# Altium project DE-140824.PrjPcb
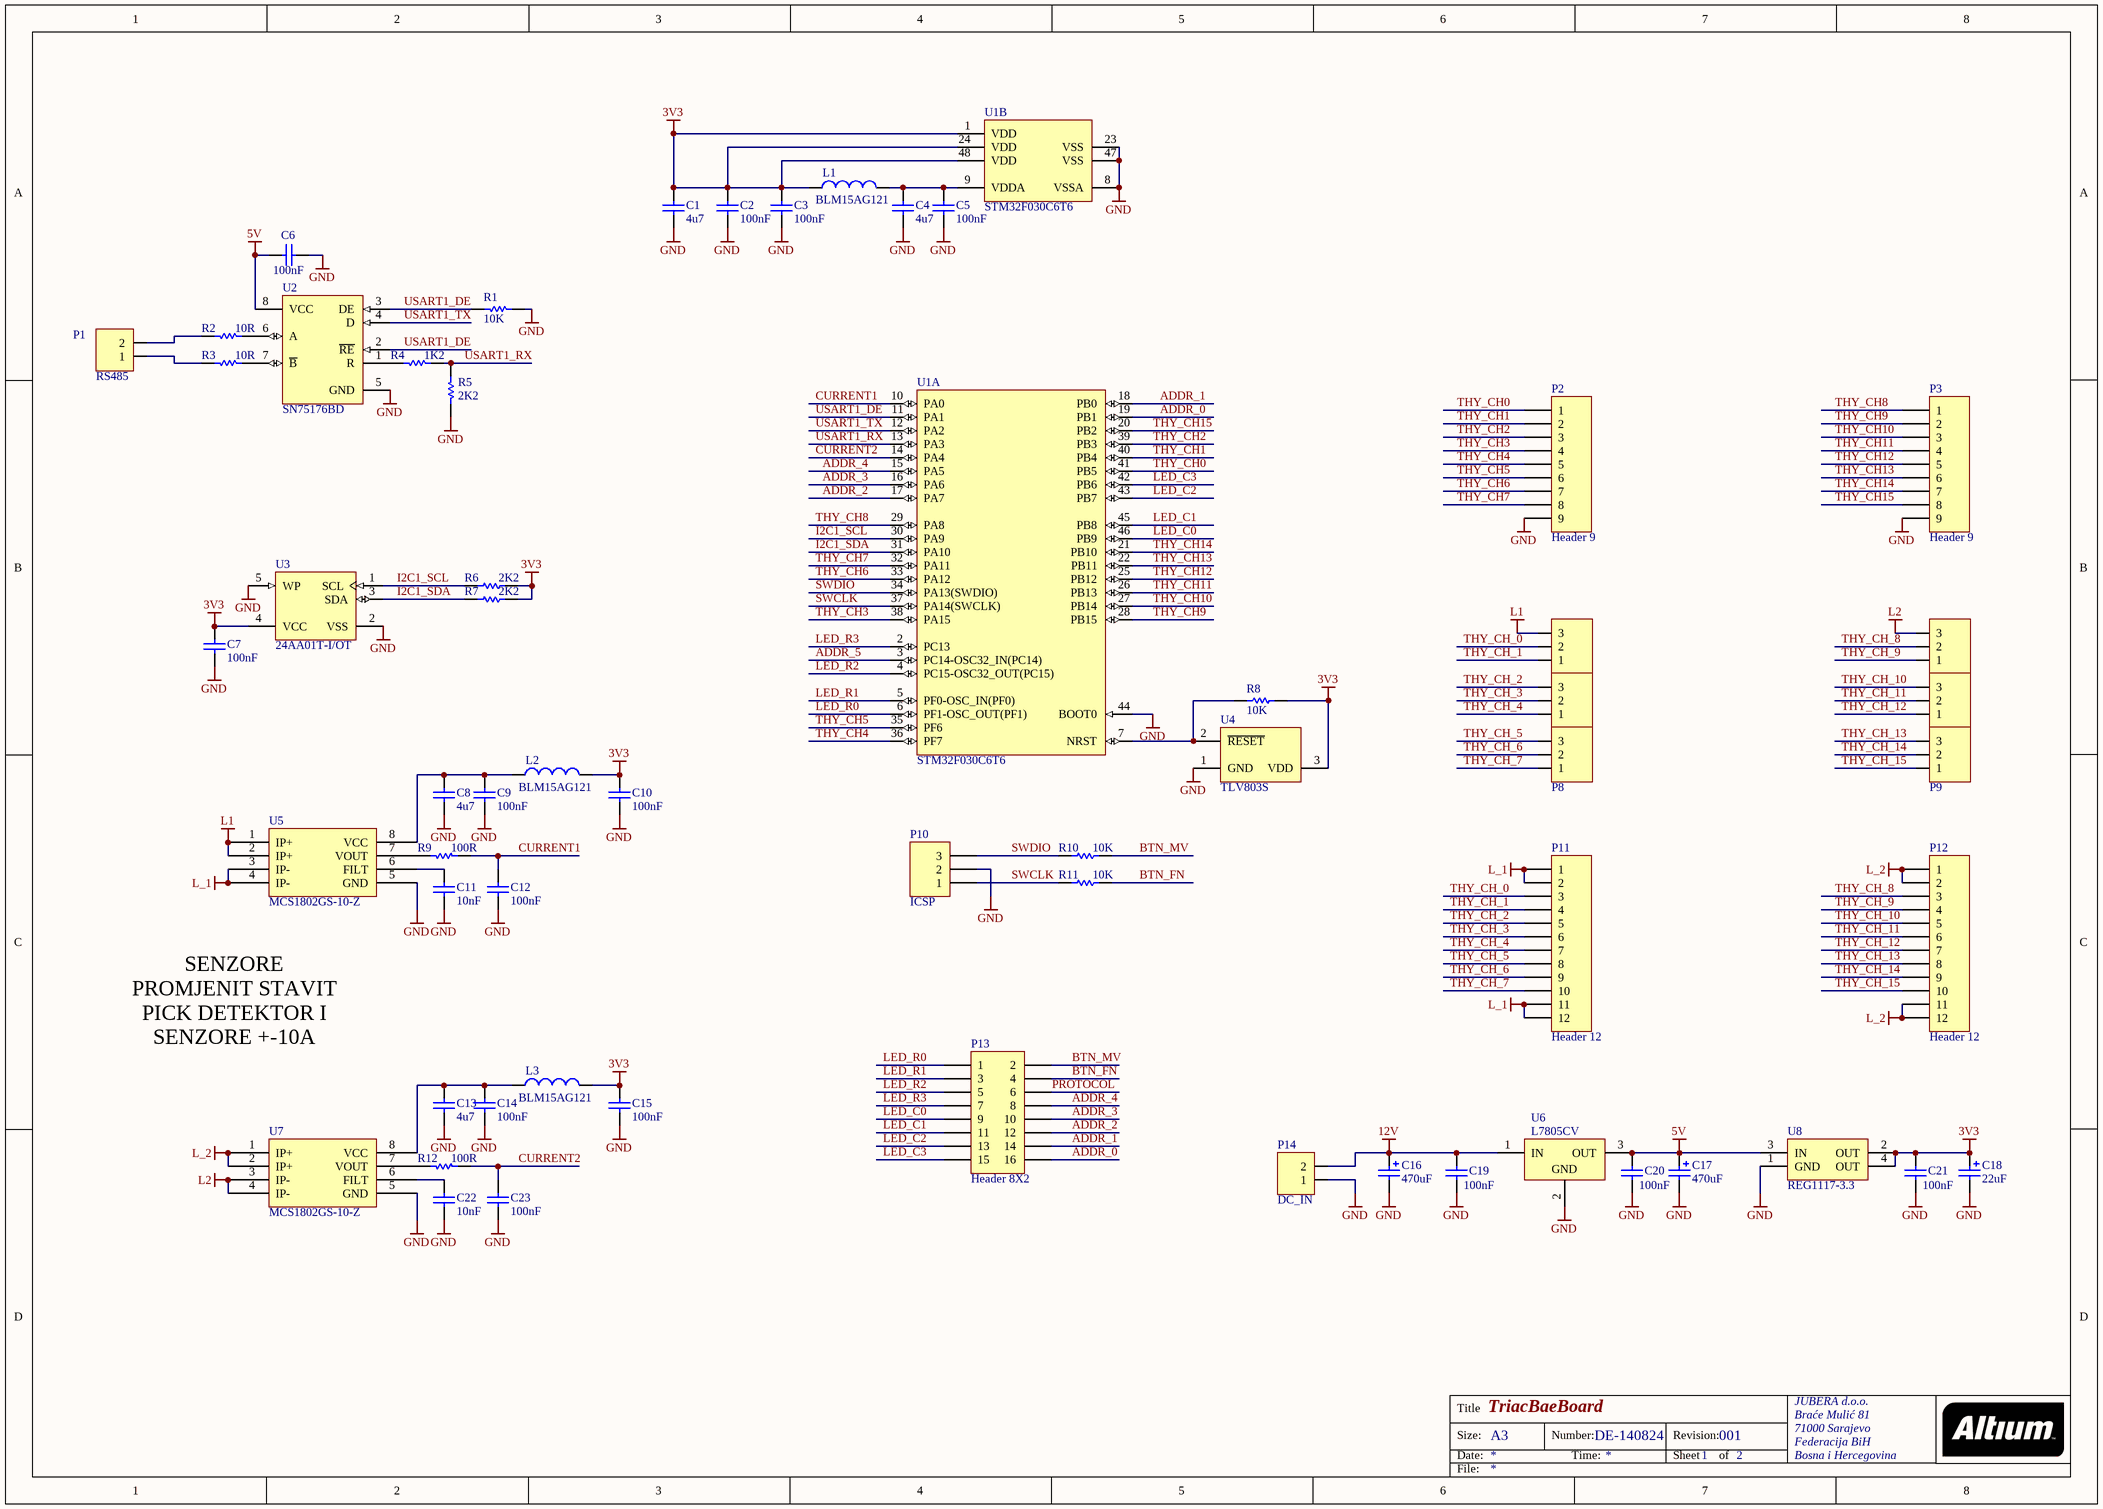
[diagram p0: DE-140824.SchDoc]
2 sheets, 202 parts. Net scope: global (net labels, ports and power ports of the same name join across sheets).
Board files: DE-140824.PcbDoc, DE-140824_1.PcbDoc
Sheets:
  DE-140824.SchDoc
  DE-140824_01.SchDoc

## Sheet DE-140824.SchDoc: TriacBaeBoard
size A3; Author: eldar6776@hotmail.com; DrawnBy: Eldar Dedic; Organization: JUBERA d.o.o.; Address1: Braće Mulić 81; Address2: 71000 Sarajevo; Address3: Federacija BiH; Address4: Bosna i Hercegovina; DocumentNumber: DE-140824; Revision: 001; SheetNumber: 1; SheetTotal: 2

### Parts
C1  value 4u7  [0805]  (hidden comment: C0805)
C2  value 100nF  [0603]  (hidden comment: C0603)
C3  value 100nF  [0603]  (hidden comment: C0603)
C4  value 4u7  [0805]  (hidden comment: C0805)
C5  value 100nF  [0603]  (hidden comment: C0603)
C6  100nF  [0603]
C7  value 100nF  [0603]  (hidden comment: C0603)
C8  value 4u7  [0805]  (hidden comment: C0805)
C9  value 100nF  [0603]  (hidden comment: C0603)
C10  value 100nF  [0603]  (hidden comment: C0603)
C11  value 10nF  [0603]  (hidden comment: C0603)
C12  value 100nF  [0603]  (hidden comment: C0603)
C13  value 4u7  [0805]  (hidden comment: C0805)
C14  value 100nF  [0603]  (hidden comment: C0603)
C15  value 100nF  [0603]  (hidden comment: C0603)
C16  470uF  [CAPPR5-10X12.5]
C17  470uF  [CAPPR5-10X12.5]
C18  22uF  [CAPPR2-5X11]
C19  100nF  [0603]
C20  100nF  [0603]
C21  100nF  [0603]
C22  value 10nF  [0603]  (hidden comment: C0603)
C23  value 100nF  [0603]  (hidden comment: C0603)
L1  BLM15AG121  [0402-A]
L2  BLM15AG121  [0402-A]
L3  BLM15AG121  [0402-A]
P1  RS485  [TERMINAL BLOK 2]
P2  Header 9  [HDR1X9]
P3  Header 9  [HDR1X9]
P4  (no value)  [TERMINAL BLOK 3]
P5  (no value)  [TERMINAL BLOK 3]
P6  (no value)  [TERMINAL BLOK 3]
P7  (no value)  [TERMINAL BLOK 3]
P8  (no value)  [TERMINAL BLOK 3]
P9  (no value)  [TERMINAL BLOK 3]
P10  ICSP  [HDR1X3]
P11  Header 12  [HDR1X12]
P12  Header 12  [HDR1X12]
P13  Header 8X2  [HDR2X8]
P14  DC_IN  [TERMINAL BLOK 2]
R1  10K  [ERA-0603]
R2  10R  [ERA-0603]
R3  10R  [ERA-0603]
R4  1K2  [ERA-0603]
R5  2K2  [ERA-0603]
R6  2K2  [ERA-0603]
R7  2K2  [ERA-0603]
R8  10K  [ERA-0603]
R9  100R  [ERA-0603]
R10  10K  [ERA-0603]
R11  10K  [ERA-0603]
R12  100R  [ERA-0603]
U1  STM32F030C6T6  [STM-LQFP48_N]  (parts A,B of 2)
U2  SN75176BD  [D008_N]
U3  24AA01T-I/OT  [SOT-23-OT5_N]
U4  TLV803S  [DBZ3_N]
U5  MCS1802GS-10-Z  [SOIC-SN8_N]
U6  L7805CV  [TO220]
U7  MCS1802GS-10-Z  [SOIC-SN8_N]
U8  REG1117-3.3  [ZZ311]

### Nets
3V3: C1.2 C2.2 C3.2 C7.2 C10.2 C15.2 C18.1 C21.2 L1.1 L2.2 L3.2 R6.2 R7.2 R8.2 U1.1(VDD) U1.24(VDD) U1.48(VDD) U3.4(VCC) U4.3(VDD) U8.2(OUT) U8.4(OUT)
5V: C6.1 C17.1 C20.2 U2.8(VCC) U6.3(OUT) U8.3(IN)
12V: C16.1 C19.2 P14.2 U6.1(IN)
GND: C1.1 C2.1 C3.1 C4.1 C5.1 C6.2 C7.1 C8.1 C9.1 C10.1 C11.1 C12.1 C13.1 C14.1 C15.1 C16.2 C17.2 C18.2 C19.1 C20.1 C21.1 C22.1 C23.1 P2.9 P3.9 P10.2 P14.1 R1.1 R5.2 U1.8(VSSA) U1.23(VSS) U1.44(BOOT0) U1.47(VSS) U2.5(GND) U3.2(VSS) U3.5(WP) U4.1(GND) U5.5(GND) U6.2(GND) U7.5(GND) U8.1(GND)
L1: P4.3 U5.1(IP+) U5.2(IP+)
L2: P5.3 U7.3(IP-) U7.4(IP-)
L_1: P11.1 P11.2 P11.11 P11.12 U5.3(IP-) U5.4(IP-)
L_2: P12.1 P12.2 P12.11 P12.12 U7.1(IP+) U7.2(IP+)
ADDR_0: P13.16 U1.19(PB1)
ADDR_1: P13.14 U1.18(PB0)
ADDR_2: P13.12 U1.17(PA7)
ADDR_3: P13.10 U1.16(PA6)
ADDR_4: P13.8 U1.15(PA5)
ADDR_5: U1.3(PC14-OSC32_IN(PC14))
BTN_FN: P13.4 R11.2
BTN_MV: P13.2 R10.2
CURRENT1: C12.2 R9.1 U1.10(PA0)
CURRENT2: C23.2 R12.1 U1.14(PA4)
I2C1_SCL: R6.1 U1.30(PA9) U3.1(SCL)
I2C1_SDA: R7.1 U1.31(PA10) U3.3(SDA)
LED_C0: P13.9 U1.46(PB9)
LED_C1: P13.11 U1.45(PB8)
LED_C2: P13.13 U1.43(PB7)
LED_C3: P13.15 U1.42(PB6)
LED_R0: P13.1 U1.6(PF1-OSC_OUT(PF1))
LED_R1: P13.3 U1.5(PF0-OSC_IN(PF0))
LED_R2: P13.5 U1.4(PC15-OSC32_OUT(PC15))
LED_R3: P13.7 U1.2(PC13)
PROTOCOL: P13.6
SWCLK: P10.1 R11.1 U1.37(PA14(SWCLK))
SWDIO: P10.3 R10.1 U1.34(PA13(SWDIO))
THY_CH0: P2.1 U1.41(PB5)
THY_CH1: P2.2 U1.40(PB4)
THY_CH2: P2.3 U1.39(PB3)
THY_CH3: P2.4 U1.38(PA15)
THY_CH4: P2.5 U1.36(PF7)
THY_CH5: P2.6 U1.35(PF6)
THY_CH6: P2.7 U1.33(PA12)
THY_CH7: P2.8 U1.32(PA11)
THY_CH8: P3.1 U1.29(PA8)
THY_CH9: P3.2 U1.28(PB15)
THY_CH10: P3.3 U1.27(PB14)
THY_CH11: P3.4 U1.26(PB13)
THY_CH12: P3.5 U1.25(PB12)
THY_CH13: P3.6 U1.22(PB11)
THY_CH14: P3.7 U1.21(PB10)
THY_CH15: P3.8 U1.20(PB2)
THY_CH_0: P4.2 P11.3
THY_CH_1: P4.1 P11.4
THY_CH_2: P6.3 P11.5
THY_CH_3: P6.2 P11.6
THY_CH_4: P6.1 P11.7
THY_CH_5: P8.3 P11.8
THY_CH_6: P8.2 P11.9
THY_CH_7: P8.1 P11.10
THY_CH_8: P5.2 P12.3
THY_CH_9: P5.1 P12.4
THY_CH_10: P7.3 P12.5
THY_CH_11: P7.2 P12.6
THY_CH_12: P7.1 P12.7
THY_CH_13: P9.3 P12.8
THY_CH_14: P9.2 P12.9
THY_CH_15: P9.1 P12.10
USART1_DE: R1.2 U1.11(PA1) U2.2(~{RE}) U2.3(DE)
USART1_RX: R4.1 R5.1 U1.13(PA3)
USART1_TX: U1.12(PA2) U2.4(D)
NetC4_2: C4.2 C5.2 L1.2 U1.9(VDDA)
NetC8_2: C8.2 C9.2 L2.1 U5.8(VCC)
NetC11_2: C11.2 U5.6(FILT)
NetC13_2: C13.2 C14.2 L3.1 U7.8(VCC)
NetC22_2: C22.2 U7.6(FILT)
NetP1_1: P1.1 R3.1
NetP1_2: P1.2 R2.1
NetR2_2: R2.2 U2.6(A)
NetR3_2: R3.2 U2.7(~{B})
NetR4_2: R4.2 U2.1(R)
NetR8_1: R8.1 U1.7(NRST) U4.2(~{RESET})
NetR9_2: R9.2 U5.7(VOUT)
NetR12_2: R12.2 U7.7(VOUT)

### Notes on the sheet
- SENZORE PROMJENIT STAVIT PICK DETEKTOR I SENZORE +-10A
- Title
- Size:
- Date:
- A3
- Number:
- Time:
- Revision:
- Sheet
- of
- File:

### Library data of the parts
C1 C4 C8 C13 = C0805: Ceramic Chip Capacitor - Standard; Note: Footprint corresponds to dimensions for bulk cassette packaging. This case size has tightened tolerances.; Published: 17-Jul-2002; LatestRevisionDate: 19-Mar-2004; LatestRevisionNote: Silkscreen size reduced.; DatasheetDocument: Mar-2001; PackageDocument: Mar-2001; PackageReference: 0805; Publisher: Altium Limited; Code_JEITA: 0805; Code_IPC: 2012[0805]; ComponentLink1Description: Manufacturer Link; ComponentLink1URL: http://www.kemet.com/; ComponentLink2Description: Datasheet; ComponentLink2URL: http://www.kemet.com/kemet/web/homepage/kechome.nsf/vapubfilesname/F3102TA.pdf/$file/F3102TA.pdf
C2 C3 C5-C7 C9-C12 C14 C15 C19-C23 = C0603: Ceramic Chip Capacitor - Standard; Note: Footprint corresponds to dimensions for bulk cassette packaging. This case size has tightened tolerances.; Published: 17-Jul-2002; LatestRevisionDate: 19-Mar-2004; LatestRevisionNote: Silkscreen size reduced.; DatasheetDocument: Mar-2001; PackageDocument: Mar-2001; PackageReference: 0603; Publisher: Altium Limited; Code_JEITA: 0603; Code_IPC: 1608 [0603]; ComponentLink1Description: Manufacturer Link; ComponentLink1URL: http://www.kemet.com/; ComponentLink2Description: Datasheet; ComponentLink2URL: http://www.kemet.com/kemet/web/homepage/kechome.nsf/vapubfilesname/F3102TA.pdf/$file/F3102TA.pdf
  C6 C19-C21: Value: 100nF
C16 C17 = EKA00DC347E00: Aluminum Electrolytic Capacitor, Radial Style with Long Leads: 470uF, 25V; Note: Refer to Manufacturer's Data Sheets for other lead formations; DrillSize: Nominal, Rounded To The Nearest 0.1mm; Published: 19-Mar-2004; DatasheetDocument: 20-Feb-2001; PackageReference: CAPPR5-10X12.5; Publisher: Altium Limited; ComponentLink1Description: Manufacturer Link; ComponentLink1URL: http://www.vishay.com/; ComponentLink2Description: Datasheet; ComponentLink2URL: http://www.vishay.com/docs/25014/eka.pdf; Value: 470uF
C18 = EKA00AA247F00: Aluminum Electrolytic Capacitor, Radial Style with Long Leads: 47uF, 35V; Note: Refer to Manufacturer's Data Sheets for other lead formations; DrillSize: Nominal, Rounded To The Nearest 0.1mm; Published: 19-Mar-2004; DatasheetDocument: 20-Feb-2001; PackageReference: CAPPR2-5X11; Publisher: Altium Limited; ComponentLink1Description: Manufacturer Link; ComponentLink1URL: http://www.vishay.com/; ComponentLink2Description: Datasheet; ComponentLink2URL: http://www.vishay.com/docs/25014/eka.pdf; Value: 47uF
L1-L3 = Chip inductor: SMD chip inductor; Code_IEC: 1005; Published: 8-Jun-2000; LatestRevisionDate: 29-May-2009; LatestRevisionNote: IPC-7351 Footprint Added.; PackageReference: 0402-A; Publisher: Altium Limited; PackageDescription: Chip Inductor; Code_JEITA: 0402
P1 P14 = TERMINAL BLOK 2: Terminal blok konektor 3,5 mm
P2 P3 = Header 9: Header, 9-Pin; LatestRevisionDate: 17-Jul-2002; LatestRevisionNote: Re-released for DXP Platform.; Publisher: Altium Limited
P4-P9 = TERMINAL BLOK 3: 3 pinski terminal blok konektor
P10 = Header 3: Header, 3-Pin; LatestRevisionDate: 17-Jul-2002; LatestRevisionNote: Re-released for DXP Platform.; Publisher: Altium Limited
P11 P12 = Header 12: Header, 12-Pin; LatestRevisionDate: 17-Jul-2002; LatestRevisionNote: Re-released for DXP Platform.; Publisher: Altium Limited
P13 = Header 8X2: Header, 8-Pin, Dual row; LatestRevisionDate: 17-Jul-2002; LatestRevisionNote: Re-released for DXP Platform.; Publisher: Altium Limited
R1-R5 R9 R12 = ERAV: Metal Film Thermosensitive Chip Resistor, 0.56 Ohm to 10k Ohm Range, 5% Tolerance, 0603 Size, 0.063 W; Note: If flow soldering, adjust pad width of PCB Footprint to 0.7 - 0.8 times the width of the resistor.; Published: 17-Dec-2003; LatestRevisionDate: 19-Mar-2004; LatestRevisionNote: Silkscreen size reduced.; PackageDocument: Mar-2003; PackageReference: ERA-0603; Publisher: Altium Limited; Code_IPC: 1608 [0603]; ComponentLink1Description: Manufacturer Link; ComponentLink1URL: http://www.panasonic.com/industrial/components/resistive_products.htm; ComponentLink2Description: Datasheet; ComponentLink2URL: http://www.panasonic.com/industrial/components/pdf/AOF0000CE1.pdf
R6-R8 R10 R11 = ERA3Y: Rectangular Thick Film Chip Resistor, 10 Ohm to 330k Ohm Range, 0.1% and 0.5% Tolerance, 0603 Size, 0.063 W; Note: If flow soldering, adjust pad width of PCB Footprint to 0.7 - 0.8 times the width of the resistor.; Published: 17-Dec-2003; LatestRevisionDate: 19-Mar-2004; LatestRevisionNote: Silkscreen size reduced.; PackageDocument: Mar-2003; PackageReference: ERA-0603; Publisher: Altium Limited; Code_IPC: 1608 [0603]; ComponentLink1Description: Manufacturer Link; ComponentLink1URL: http://www.panasonic.com/industrial/components/resistive_products.htm; ComponentLink2Description: Datasheet; ComponentLink2URL: http://www.panasonic.com/industrial/components/pdf/AOA0000CE8.pdf
U1 = STM32F030C6T6: ARM Cortex-M0 32-bit MCU, 32 KB Flash, 4 KB Internal RAM, 39 I/Os, 48-pin LQFP, -40 to 85 degC, Tray; FLASH Size (Prog) (kB): 32; I/Os (High Current): 39; Internal RAM Size (kB): 4; Operating Frequency(F) (Processor speed) (MHz): 48; Supply Voltage(Vcc) min (V): 2.4; DatasheetVersion: Rev. 1; PackageVersion: Rev. 6, 06/2013; PackageReference: LQFP48; PackageDescription: 48-Pin Low Profile Quad Flat Package, 7 x 7 mm Body, 0.5 mm Pitch; Supplier 1: Digi-Key; Supplier Part Number 1: 497-14042-ND; Supplier 2: Newark; Supplier Part Number 2: 06X3646; Supplier 3: Mouser; Supplier Part Number 3: 511-STM32F030C6T6; Core: ARM Cortex-M0; Packing: Tray; Mounting Technology: Surface Mount; PartNumber: STM32F030C6T6; ComponentLink1Description: Manufacturer URL; ComponentLink1URL: http://www.st.com/web/en/home.html; ComponentLink2Description: Datasheet; ComponentLink2URL: http://www.st.com/st-web-ui/static/active/en/resource/technical/document/datasheet/DM00088500.pdf; ComponentLink3Description: Package Specification; ComponentLink3URL: http://www.st.com/st-web-ui/static/active/en/resource/technical/document/datasheet/DM00058181.pdf
U2 = SN75176BD: Differential Bus Transceiver; Note: Receiver Hysteresis of 50mV Typical; Published: 15-May-2002; LatestRevisionDate: 13-Apr-2006; LatestRevisionNote: IPC-7351 Footprint Added.; DatasheetVersion: Sep-1989; PackageVersion: Jan-1998; PackageReference: D008; Publisher: Altium Limited; PackageDescription: 8-Pin Small Outline Integrated Circuit 1.27 mm Pitch; Code_IPC: SOIC127P600-8; ComponentLink1Description: Manufacturer Link; ComponentLink1URL: http://www.ti.com/; ComponentLink2Description: Datasheet; ComponentLink2URL: http://www-s.ti.com/sc/ds/sn75176b.pdf
U3 = 24AA01T-I/OT: 1Kbit, 400kHz, 1.8V, I2C Serial EEPROM, 5-Pin SOT-23, Industrial Temperature, Tape and Reel; Published: 29-Jan-2009; DatasheetVersion: revJ, Jan-2009; PackageVersion: revBB, Aug-2009; PackageReference: SOT-23-OT5; Publisher: Altium Limited; PackageDescription: 5-Lead Plastic Small Outline Transistor (OT) [SOT-23]; Supplier 1: Digi-Key; Supplier Part Number 1: 24AA01T-I/OTTR-ND; Supplier 2: Digi-Key; Supplier Part Number 2: 24AA01T-I/OTCT-ND; Supplier 3: Digi-Key; Supplier Part Number 3: 24AA01T-I/OTDKR-ND; Supplier 4: Farnell; Supplier Part Number 4: 1331269; Code_IPC: SOT23-5; ComponentLink1Description: Datasheet; ComponentLink1URL: http://ww1.microchip.com/downloads/en/DeviceDoc/21711J.pdf; ComponentLink2Description: Packaging Specification; ComponentLink2URL: http://www.microchip.com/stellent/groups/techpub_sg/documents/packagingspec/en012702.pdf; ComponentLink3Description: Microchip.com Home; ComponentLink3URL: http://www.microchip.com/
U4 = TLV803MDBZR: Voltage Supervisor with Active-Low, Open Drain Reset, 1 Supply Monitored, -40 to 125 degC, 3-pin SOT-23 (DBZ), Green (RoHS & no Sb/Br); Manufacturer: Texas Instruments; # of supplies monitored: 1; Iq(Typ)(uA): 9; Output Driver Type / Reset Output: Active-low, Open-drain; Rating: Catalog; Reset Threshold Accuracy(%): 2; SubFamily: Supervisor and Reset IC; Threshold Voltage 1 (typ)(Typ)(V): 4.38; Time Delay(ms): 200; VCC(Max)(V): 6; VCC(Min)(V): 1.1; DatasheetVersion: SBVS157B; PackageVersion: revB, Apr-2005; PackageReference: DBZ3; PackageDescription: 3-Pin Plastic Small-Outline Package, 0.95 mm Pitch, 2.4 mm Lead Span; Supplier 1: Digi-Key; Supplier Part Number 1: 296-29194-2-ND; Supplier 2: Digi-Key; Supplier Part Number 2: 296-29194-1-ND; Supplier 3: Digi-Key; Supplier Part Number 3: 296-29194-6-ND; Supplier 4: Newark; Supplier Part Number 4: 58T0286; Supplier 5: Mouser; Supplier Part Number 5: 595-TLV803MDBZR; Mounting Technology: Surface Mount; Code_JEDEC: TO-236-AB; PartNumber: TLV803MDBZR; ComponentLink1Description: Datasheet; ComponentLink1URL: http://www.ti.com/general/docs/lit/getliterature.tsp?genericPartNumber=TLV803M&fileType=pdf
U5 U7 = ACS71240
U6 = L7805CV: Positive Voltage Regulator, 5V, 3-Pin TO-220; DatasheetVersion: Nov-2011; PackageVersion: ver3.0; PackageReference: TO220; PackageDescription: TO, Thru-Hole, Vertical, Heatsink Mounted; 3 In-Line Leads; Pitch 2.54 mm; PartNumber: L7805CV; ComponentLink1Description: Manufacturer URL; ComponentLink1URL: http://www.st.com; ComponentLink2Description: Datasheet; ComponentLink2URL: http://www.st.com/internet/com/TECHNICAL_RESOURCES/TECHNICAL_LITERATURE/DATASHEET/CD00000444.pdf; ComponentLink3Description: Package Specification; ComponentLink3URL: http://www.st.com/internet/com/TECHNICAL_RESOURCES/TECHNICAL_LITERATURE/PACKAGE_INFORMATION/CD00004649.pdf
U8 = REG1117-3.3: 800mA and 1A Low Dropout Positive Regulator 2.85V, 3.3V, 5V, and Adjustable; Published: 8-Jun-2000; LatestRevisionDate: 17-Jul-2002; LatestRevisionNote: Re-released for DXP Platform.; DatasheetVersion: Sep-1997; PackageVersion: revC; PackageReference: ZZ311; Publisher: Altium Limited; PackageDescription: SOT-223/SC-73; 4 Leads; Body 6.7 x 7.3 mm, inc. leads (LxW max); ComponentLink1Description: Manufacturer Link; ComponentLink1URL: http://www.ti.com/; ComponentLink2Description: Datasheet; ComponentLink2URL: http://www-s.ti.com/sc/ds/REG1117.pdf

## Sheet DE-140824_01.SchDoc: JalousieBoard
size A3; Author: eldar6776@hotmail.com; DrawnBy: Eldar Dedic; Organization: JUBERA d.o.o.; Address1: Braće Mulić 81; Address2: 71000 Sarajevo; Address3: Federacija BiH; Address4: Bosna i Hercegovina; DocumentNumber: DE-120824; Revision: 001; SheetNumber: 1; SheetTotal: 2
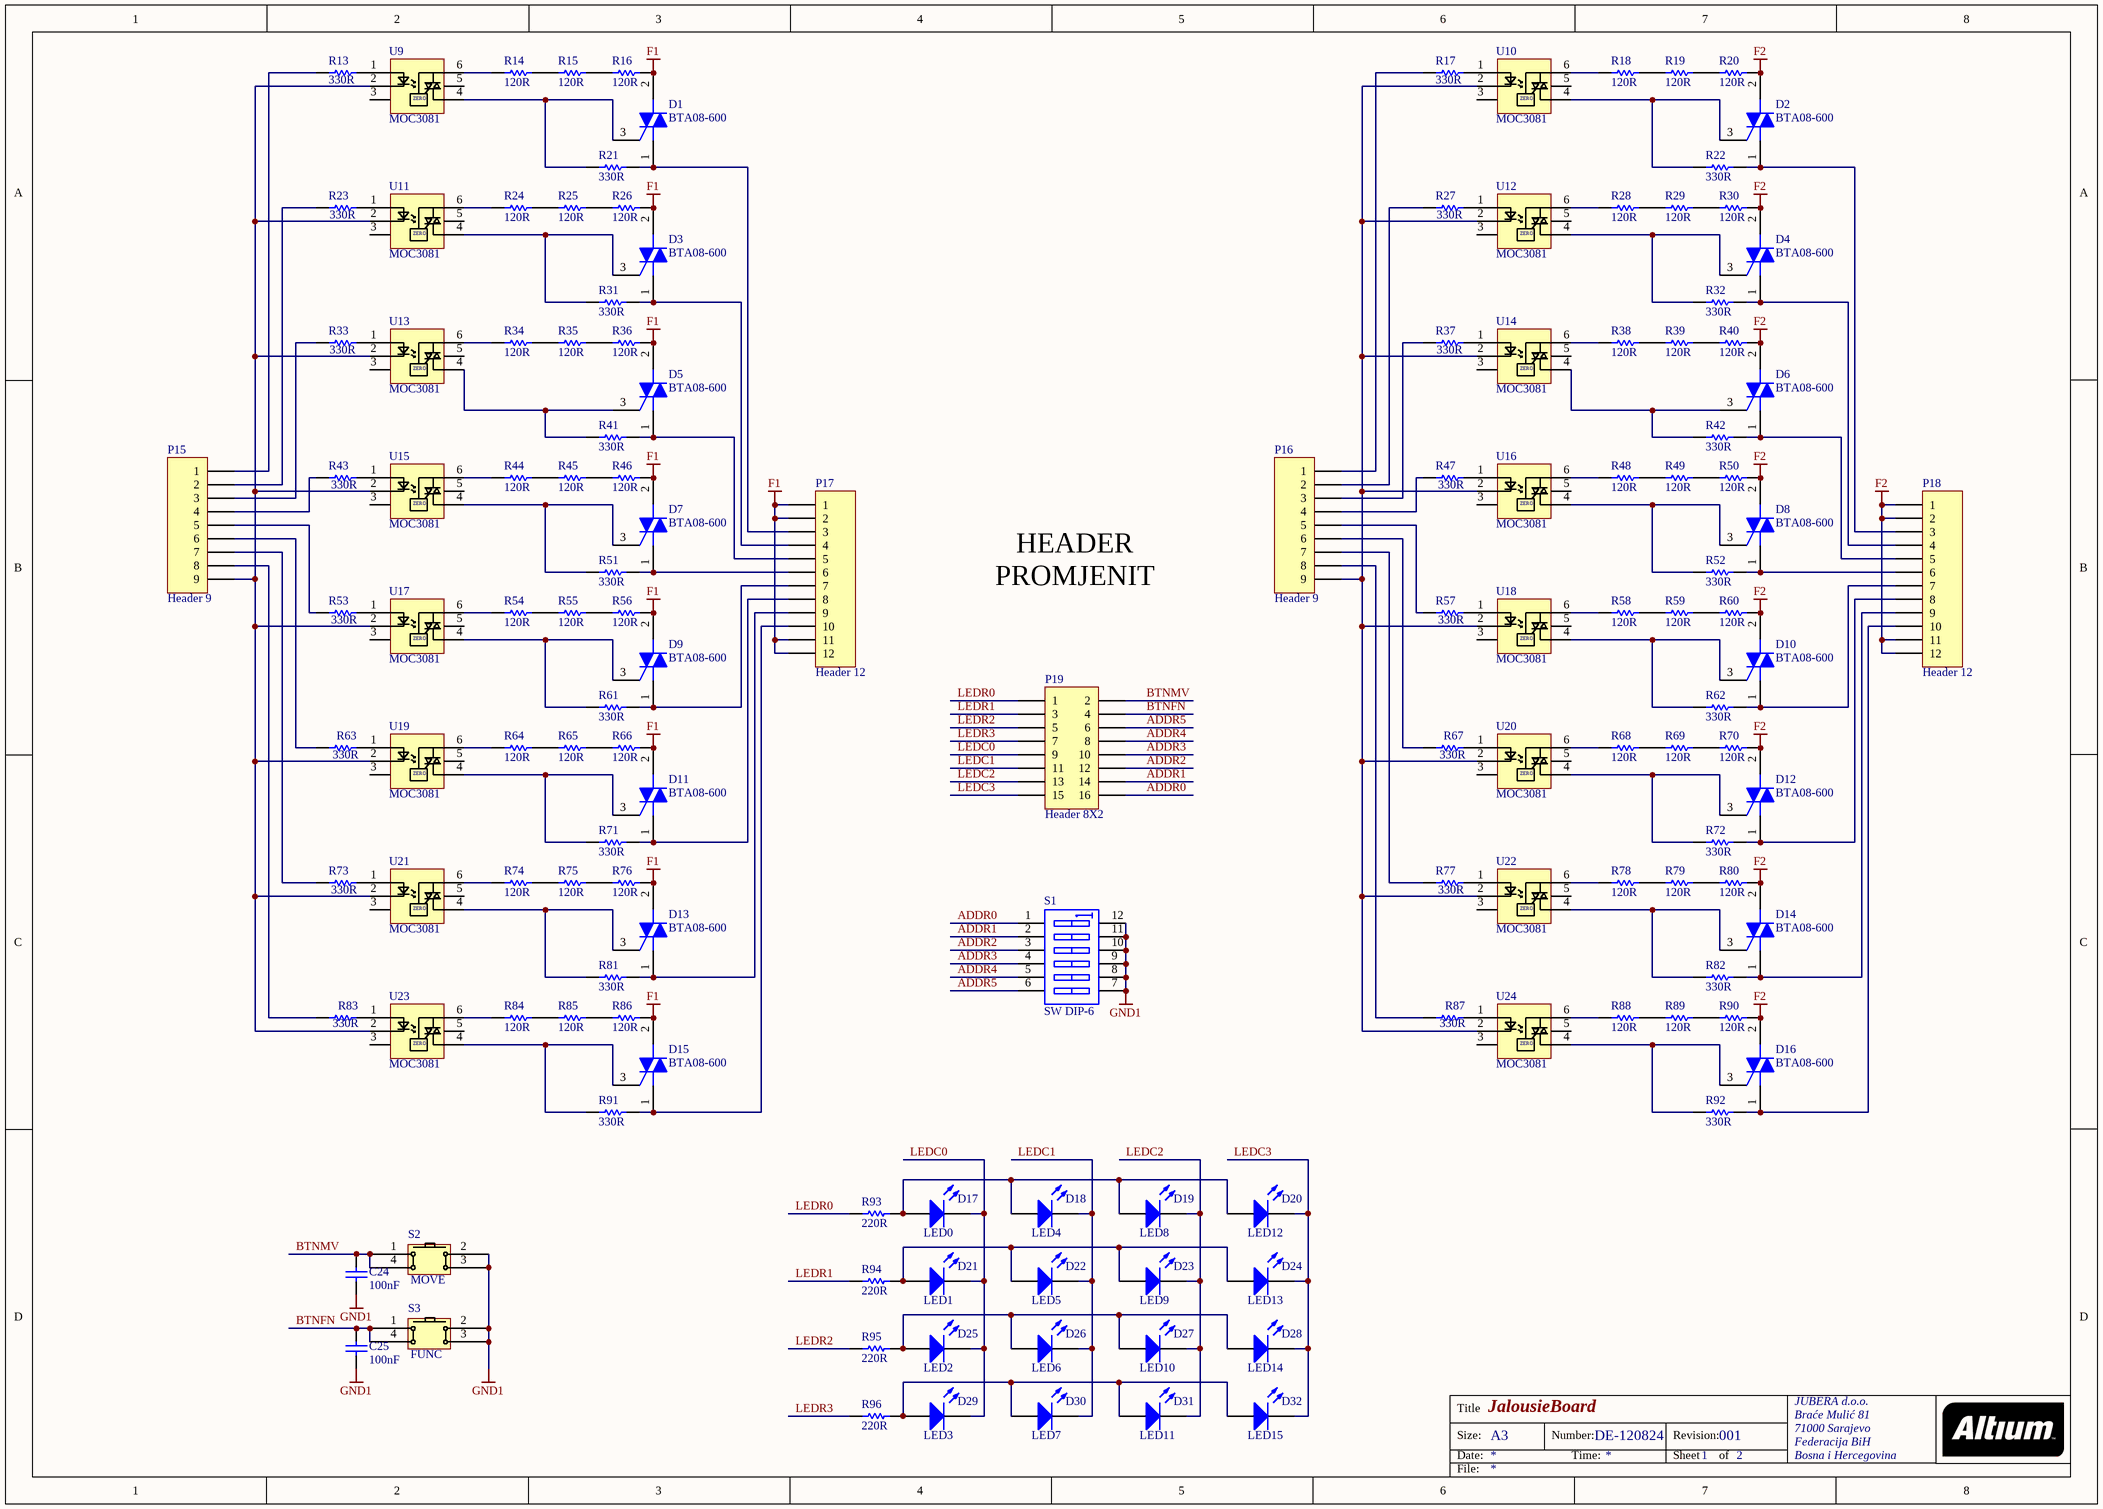
[diagram p1: DE-140824_01.SchDoc]

### Parts
C24  value 100nF  [0603]  (hidden comment: C0603)
C25  value 100nF  [0603]  (hidden comment: C0603)
D1  BTA08-600  [ONSC-TO-220-3-221A-07]
D2  BTA08-600  [ONSC-TO-220-3-221A-07]
D3  BTA08-600  [ONSC-TO-220-3-221A-07]
D4  BTA08-600  [ONSC-TO-220-3-221A-07]
D5  BTA08-600  [ONSC-TO-220-3-221A-07]
D6  BTA08-600  [ONSC-TO-220-3-221A-07]
D7  BTA08-600  [ONSC-TO-220-3-221A-07]
D8  BTA08-600  [ONSC-TO-220-3-221A-07]
D9  BTA08-600  [ONSC-TO-220-3-221A-07]
D10  BTA08-600  [ONSC-TO-220-3-221A-07]
D11  BTA08-600  [ONSC-TO-220-3-221A-07]
D12  BTA08-600  [ONSC-TO-220-3-221A-07]
D13  BTA08-600  [ONSC-TO-220-3-221A-07]
D14  BTA08-600  [ONSC-TO-220-3-221A-07]
D15  BTA08-600  [ONSC-TO-220-3-221A-07]
D16  BTA08-600  [ONSC-TO-220-3-221A-07]
D17  LED0  [1.6X0.8X0.8]
D18  LED4  [1.6X0.8X0.8]
D19  LED8  [1.6X0.8X0.8]
D20  LED12  [1.6X0.8X0.8]
D21  LED1  [1.6X0.8X0.8]
D22  LED5  [1.6X0.8X0.8]
D23  LED9  [1.6X0.8X0.8]
D24  LED13  [1.6X0.8X0.8]
D25  LED2  [1.6X0.8X0.8]
D26  LED6  [1.6X0.8X0.8]
D27  LED10  [1.6X0.8X0.8]
D28  LED14  [1.6X0.8X0.8]
D29  LED3  [1.6X0.8X0.8]
D30  LED7  [1.6X0.8X0.8]
D31  LED11  [1.6X0.8X0.8]
D32  LED15  [1.6X0.8X0.8]
P15  Header 9  [HDR1X9]
P16  Header 9  [HDR1X9]
P17  Header 12  [HDR1X12]
P18  Header 12  [HDR1X12]
P19  Header 8X2  [HDR2X8]
R13  330R  [ERA-0603]
R14  120R  [ERA-0805]
R15  120R  [ERA-0805]
R16  120R  [ERA-0805]
R17  330R  [ERA-0603]
R18  120R  [ERA-0805]
R19  120R  [ERA-0805]
R20  120R  [ERA-0805]
R21  330R  [ERA-0805]
R22  330R  [ERA-0805]
R23  330R  [ERA-0603]
R24  120R  [ERA-0805]
R25  120R  [ERA-0805]
R26  120R  [ERA-0805]
R27  330R  [ERA-0603]
R28  120R  [ERA-0805]
R29  120R  [ERA-0805]
R30  120R  [ERA-0805]
R31  330R  [ERA-0805]
R32  330R  [ERA-0805]
R33  330R  [ERA-0603]
R34  120R  [ERA-0805]
R35  120R  [ERA-0805]
R36  120R  [ERA-0805]
R37  330R  [ERA-0603]
R38  120R  [ERA-0805]
R39  120R  [ERA-0805]
R40  120R  [ERA-0805]
R41  330R  [ERA-0805]
R42  330R  [ERA-0805]
R43  330R  [ERA-0603]
R44  120R  [ERA-0805]
R45  120R  [ERA-0805]
R46  120R  [ERA-0805]
R47  330R  [ERA-0603]
R48  120R  [ERA-0805]
R49  120R  [ERA-0805]
R50  120R  [ERA-0805]
R51  330R  [ERA-0805]
R52  330R  [ERA-0805]
R53  330R  [ERA-0603]
R54  120R  [ERA-0805]
R55  120R  [ERA-0805]
R56  120R  [ERA-0805]
R57  330R  [ERA-0603]
R58  120R  [ERA-0805]
R59  120R  [ERA-0805]
R60  120R  [ERA-0805]
R61  330R  [ERA-0805]
R62  330R  [ERA-0805]
R63  330R  [ERA-0603]
R64  120R  [ERA-0805]
R65  120R  [ERA-0805]
R66  120R  [ERA-0805]
R67  330R  [ERA-0603]
R68  120R  [ERA-0805]
R69  120R  [ERA-0805]
R70  120R  [ERA-0805]
R71  330R  [ERA-0805]
R72  330R  [ERA-0805]
R73  330R  [ERA-0603]
R74  120R  [ERA-0805]
R75  120R  [ERA-0805]
R76  120R  [ERA-0805]
R77  330R  [ERA-0603]
R78  120R  [ERA-0805]
R79  120R  [ERA-0805]
R80  120R  [ERA-0805]
R81  330R  [ERA-0805]
R82  330R  [ERA-0805]
R83  330R  [ERA-0603]
R84  120R  [ERA-0805]
R85  120R  [ERA-0805]
R86  120R  [ERA-0805]
R87  330R  [ERA-0603]
R88  120R  [ERA-0805]
R89  120R  [ERA-0805]
R90  120R  [ERA-0805]
R91  330R  [ERA-0805]
R92  330R  [ERA-0805]
R93  220R  [ERA-0603]
R94  220R  [ERA-0603]
R95  220R  [ERA-0603]
R96  220R  [ERA-0603]
S1  SW DIP-6  [DIP-12/SW]
S2  MOVE  [TACTILE_SWITCH]
S3  FUNC  [TACTILE_SWITCH]
U9  MOC3081  [DIP6]
U10  MOC3081  [DIP6]
U11  MOC3081  [DIP6]
U12  MOC3081  [DIP6]
U13  MOC3081  [DIP6]
U14  MOC3081  [DIP6]
U15  MOC3081  [DIP6]
U16  MOC3081  [DIP6]
U17  MOC3081  [DIP6]
U18  MOC3081  [DIP6]
U19  MOC3081  [DIP6]
U20  MOC3081  [DIP6]
U21  MOC3081  [DIP6]
U22  MOC3081  [DIP6]
U23  MOC3081  [DIP6]
U24  MOC3081  [DIP6]

### Nets
F1: D1.2(MT2) D3.2(MT2) D5.2(MT2) D7.2(MT2) D9.2(MT2) D11.2(MT2) D13.2(MT2) D15.2(MT2) P17.1 P17.2 P17.11 P17.12 R16.2 R26.2 R36.2 R46.2 R56.2 R66.2 R76.2 R86.2
F2: D2.2(MT2) D4.2(MT2) D6.2(MT2) D8.2(MT2) D10.2(MT2) D12.2(MT2) D14.2(MT2) D16.2(MT2) P18.1 P18.2 P18.11 P18.12 R20.2 R30.2 R40.2 R50.2 R60.2 R70.2 R80.2 R90.2
GND1: C24.2 C25.2 S1.7(B6) S1.8(B5) S1.9(B4) S1.10(B3) S1.11(B2) S1.12(B1) S2.2 S2.3 S3.2 S3.3
ADDR0: P19.16 S1.1(A1)
ADDR1: P19.14 S1.2(A2)
ADDR2: P19.12 S1.3(A3)
ADDR3: P19.10 S1.4(A4)
ADDR4: P19.8 S1.5(A5)
ADDR5: P19.6 S1.6(A6)
BTNFN: C25.1 P19.4 S3.1 S3.4
BTNMV: C24.1 P19.2 S2.1 S2.4
LEDC0: D17.2(K) D21.2(K) D25.2(K) D29.2(K) P19.9
LEDC1: D18.2(K) D22.2(K) D26.2(K) D30.2(K) P19.11
LEDC2: D19.2(K) D23.2(K) D27.2(K) D31.2(K) P19.13
LEDC3: D20.2(K) D24.2(K) D28.2(K) D32.2(K) P19.15
LEDR0: P19.1 R93.1
LEDR1: P19.3 R94.1
LEDR2: P19.5 R95.1
LEDR3: P19.7 R96.1
NetD1_1: D1.1(MT1) P17.3 R21.2
NetD1_3: D1.3(G) R21.1 U9.4
NetD2_1: D2.1(MT1) P18.3 R22.2
NetD2_3: D2.3(G) R22.1 U10.4
NetD3_1: D3.1(MT1) P17.4 R31.2
NetD3_3: D3.3(G) R31.1 U11.4
NetD4_1: D4.1(MT1) P18.4 R32.2
NetD4_3: D4.3(G) R32.1 U12.4
NetD5_1: D5.1(MT1) P17.5 R41.2
NetD5_3: D5.3(G) R41.1 U13.4
NetD6_1: D6.1(MT1) P18.5 R42.2
NetD6_3: D6.3(G) R42.1 U14.4
NetD7_1: D7.1(MT1) P17.6 R51.2
NetD7_3: D7.3(G) R51.1 U15.4
NetD8_1: D8.1(MT1) P18.6 R52.2
NetD8_3: D8.3(G) R52.1 U16.4
NetD9_1: D9.1(MT1) P17.7 R61.2
NetD9_3: D9.3(G) R61.1 U17.4
NetD10_1: D10.1(MT1) P18.7 R62.2
NetD10_3: D10.3(G) R62.1 U18.4
NetD11_1: D11.1(MT1) P17.8 R71.2
NetD11_3: D11.3(G) R71.1 U19.4
NetD12_1: D12.1(MT1) P18.8 R72.2
NetD12_3: D12.3(G) R72.1 U20.4
NetD13_1: D13.1(MT1) P17.9 R81.2
NetD13_3: D13.3(G) R81.1 U21.4
NetD14_1: D14.1(MT1) P18.9 R82.2
NetD14_3: D14.3(G) R82.1 U22.4
NetD15_1: D15.1(MT1) P17.10 R91.2
NetD15_3: D15.3(G) R91.1 U23.4
NetD16_1: D16.1(MT1) P18.10 R92.2
NetD16_3: D16.3(G) R92.1 U24.4
NetD17_1: D17.1(A) D18.1(A) D19.1(A) D20.1(A) R93.2
NetD21_1: D21.1(A) D22.1(A) D23.1(A) D24.1(A) R94.2
NetD25_1: D25.1(A) D26.1(A) D27.1(A) D28.1(A) R95.2
NetD29_1: D29.1(A) D30.1(A) D31.1(A) D32.1(A) R96.2
NetP15_1: P15.1 R13.1
NetP15_2: P15.2 R23.1
NetP15_3: P15.3 R33.1
NetP15_4: P15.4 R43.1
NetP15_5: P15.5 R53.1
NetP15_6: P15.6 R63.1
NetP15_7: P15.7 R73.1
NetP15_8: P15.8 R83.1
NetP15_9: P15.9 U9.2 U11.2 U13.2 U15.2 U17.2 U19.2 U21.2 U23.2
NetP16_1: P16.1 R17.1
NetP16_2: P16.2 R27.1
NetP16_3: P16.3 R37.1
NetP16_4: P16.4 R47.1
NetP16_5: P16.5 R57.1
NetP16_6: P16.6 R67.1
NetP16_7: P16.7 R77.1
NetP16_8: P16.8 R87.1
NetP16_9: P16.9 U10.2 U12.2 U14.2 U16.2 U18.2 U20.2 U22.2 U24.2
NetR13_2: R13.2 U9.1
NetR14_1: R14.1 U9.6
NetR14_2: R14.2 R15.1
NetR15_2: R15.2 R16.1
NetR17_2: R17.2 U10.1
NetR18_1: R18.1 U10.6
NetR18_2: R18.2 R19.1
NetR19_2: R19.2 R20.1
NetR23_2: R23.2 U11.1
NetR24_1: R24.1 U11.6
NetR24_2: R24.2 R25.1
NetR25_2: R25.2 R26.1
NetR27_2: R27.2 U12.1
NetR28_1: R28.1 U12.6
NetR28_2: R28.2 R29.1
NetR29_2: R29.2 R30.1
NetR33_2: R33.2 U13.1
NetR34_1: R34.1 U13.6
NetR34_2: R34.2 R35.1
NetR35_2: R35.2 R36.1
NetR37_2: R37.2 U14.1
NetR38_1: R38.1 U14.6
NetR38_2: R38.2 R39.1
NetR39_2: R39.2 R40.1
NetR43_2: R43.2 U15.1
NetR44_1: R44.1 U15.6
NetR44_2: R44.2 R45.1
NetR45_2: R45.2 R46.1
NetR47_2: R47.2 U16.1
NetR48_1: R48.1 U16.6
NetR48_2: R48.2 R49.1
NetR49_2: R49.2 R50.1
NetR53_2: R53.2 U17.1
NetR54_1: R54.1 U17.6
NetR54_2: R54.2 R55.1
NetR55_2: R55.2 R56.1
NetR57_2: R57.2 U18.1
NetR58_1: R58.1 U18.6
NetR58_2: R58.2 R59.1
NetR59_2: R59.2 R60.1
NetR63_2: R63.2 U19.1
NetR64_1: R64.1 U19.6
NetR64_2: R64.2 R65.1
NetR65_2: R65.2 R66.1
NetR67_2: R67.2 U20.1
NetR68_1: R68.1 U20.6
NetR68_2: R68.2 R69.1
NetR69_2: R69.2 R70.1
NetR73_2: R73.2 U21.1
NetR74_1: R74.1 U21.6
NetR74_2: R74.2 R75.1
NetR75_2: R75.2 R76.1
NetR77_2: R77.2 U22.1
NetR78_1: R78.1 U22.6
NetR78_2: R78.2 R79.1
NetR79_2: R79.2 R80.1
NetR83_2: R83.2 U23.1
NetR84_1: R84.1 U23.6
NetR84_2: R84.2 R85.1
NetR85_2: R85.2 R86.1
NetR87_2: R87.2 U24.1
NetR88_1: R88.1 U24.6
NetR88_2: R88.2 R89.1
NetR89_2: R89.2 R90.1

Not connected (* = marked no-connect by the designer): U9 3 5; U10 3 5; U11 3 5; U12 3 5; U13 3 5; U14 3 5; U15 3 5; U16 3 5; U17 3 5; U18 3 5; U19 3 5; U20 3 5; U21 3 5; U22 3 5; U23 3 5; U24 3 5

### Notes on the sheet
- HEADER PROMJENIT FALI MASA
- Title
- Size:
- Date:
- A3
- Number:
- Time:
- Revision:
- Sheet
- of
- File:
- (in symbol MOC3081) ZERO

### Library data of the parts
C24 C25 = C0603: as C2 on sheet DE-140824; Published: 17-Jul-2002; LatestRevisionDate: 19-Mar-2004; LatestRevisionNote: Silkscreen size reduced.; DatasheetDocument: Mar-2001; PackageDocument: Mar-2001; PackageReference: 0603; Publisher: Altium Limited; Code_JEITA: 0603; Code_IPC: 1608 [0603]; ComponentLink1Description: Manufacturer Link; ComponentLink1URL: http://www.kemet.com/; ComponentLink2Description: Datasheet; ComponentLink2URL: http://www.kemet.com/kemet/web/homepage/kechome.nsf/vapubfilesname/F3102TA.pdf/$file/F3102TA.pdf
D1-D16 = BTA08-600BW3G: Triacs, Silicon Bidirectional Thyristor, 3-Pin TO-220, Pb-Free, Tube; Manufacturer: On Semiconductor; IGT Max (mA): 50; IT(RMS) Max (A): 8; ITSM Max (A): 90; DatasheetVersion: Rev. 1; PackageVersion: Rev. O, 07/2008; PackageReference: TO-220-3-221A-07; PackageDescription: 3-Pin Flange Mount, Vertical Straight Lead, Body 9.97 x 4.445 mm, Pitch 2.54 mm; Supplier 1: Digi-Key; Supplier Part Number 1: BTA08-600BW3G-ND; Supplier 2: Newark; Supplier Part Number 2: 13P2072; Supplier 3: Mouser; Supplier Part Number 3: 863-BTA08-600BW3G; Packing: Tube; RoHS: Pb-Free; Mounting Technology: Through Hole; PartNumber: BTA08-600BW3G; ComponentLink1Description: Manufacturer URL; ComponentLink1URL: http://www.onsemi.com/; ComponentLink2Description: Datasheet; ComponentLink2URL: http://www.onsemi.com/pub_link/Collateral/BTA08-600BW3-D.PDF; ComponentLink3Description: Package Specification; ComponentLink3URL: http://www.onsemi.com/pub_link/Collateral/221A-07.PDF
D17-D32 = HSMB-C190: Blue Surface Mount Chip LED, Blue; LuminousIntensity: 1.6mcd (Minimum).; PCB_Layout: Complies with manufacturer's recommendation.; Published: 11-Dec-2002; DatasheetVersion: 26-Feb-2002; PackageVersion: Mar-2002; PackageReference: 1.6X0.8X0.8; Publisher: Altium Limited; PackageDescription: SM LED; 2 Flat Leads; LED_Colour: Blue; ComponentLink1Description: Manufacturer Link; ComponentLink1URL: http://www.avagotech.com/; ComponentLink2Description: Datasheet; ComponentLink2URL: http://cp.literature.agilent.com/litweb/pdf/5988-5211EN.pdf
P15 P16 = Header 9: Header, 9-Pin; LatestRevisionDate: 17-Jul-2002; LatestRevisionNote: Re-released for DXP Platform.; Publisher: Altium Limited
P17 P18 = Header 12: Header, 12-Pin; LatestRevisionDate: 17-Jul-2002; LatestRevisionNote: Re-released for DXP Platform.; Publisher: Altium Limited
P19 = Header 8X2: Header, 8-Pin, Dual row; LatestRevisionDate: 17-Jul-2002; LatestRevisionNote: Re-released for DXP Platform.; Publisher: Altium Limited
R13 R17 R23 R27 R33 R37 R43 R47 R53 R57 R63 R67 R73 R77 R83 R87 = ERA3Y: as R6 on sheet DE-140824; Published: 17-Dec-2003; LatestRevisionDate: 19-Mar-2004; LatestRevisionNote: Silkscreen size reduced.; PackageDocument: Mar-2003; PackageReference: ERA-0603; Publisher: Altium Limited; Code_IPC: 1608 [0603]; ComponentLink1Description: Manufacturer Link; ComponentLink1URL: http://www.panasonic.com/industrial/components/resistive_products.htm; ComponentLink2Description: Datasheet; ComponentLink2URL: http://www.panasonic.com/industrial/components/pdf/AOA0000CE8.pdf
R14-R16 R18-R22 R24-R26 R28-R32 R34-R36 R38-R42 R44-R46 R48-R52 R54-R56 R58-R62 R64-R66 R68-R72 R74-R76 R78-R82 R84-R86 R88-R96 = ERAS: Metal Film Thermosensitive Chip Resistor, 0.56 Ohm to 10k Ohm Range, 5% Tolerance, 0805 Size, 0.1 W; Note: If flow soldering, adjust pad width of PCB Footprint to 0.7 - 0.8 times the width of the resistor.; Published: 17-Dec-2003; LatestRevisionDate: 19-Mar-2004; LatestRevisionNote: Silkscreen size reduced.; PackageDocument: Mar-2003; PackageReference: ERA-0805; Publisher: Altium Limited; Code_IPC: 2012 [0805]; ComponentLink1Description: Manufacturer Link; ComponentLink1URL: http://www.panasonic.com/industrial/components/resistive_products.htm; ComponentLink2Description: Datasheet; ComponentLink2URL: http://www.panasonic.com/industrial/components/pdf/AOF0000CE1.pdf
S1 = SW DIP-6: DIP Switch, 6 Position, SPST; Published: 24-Mar-1999; LatestRevisionDate: 17-Jul-2002; LatestRevisionNote: Re-released for DXP Platform.; PackageReference: DIP-12/SW; Publisher: Altium Limited; PackageDescription: DIP Switch; 12 Leads
S2 S3 = TACKTILE_SWITCH
U9-U24 = MOC3081: Zero-Cross Optoisolator Triac Driver